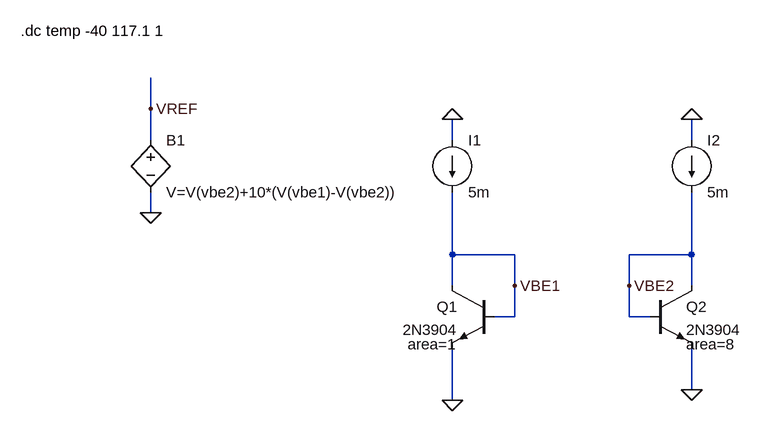
[diagram p0: schematic Ideal_Bandgap_Model.asc]
Ideal_Bandgap_Model.asc, the LTspice schematic file:
Version 4.1
SHEET 1 880 680
WIRE -64 128 -64 80
WIRE -64 176 -64 128
WIRE 400 176 400 144
WIRE 768 176 768 144
WIRE -64 288 -64 256
WIRE 400 352 400 256
WIRE 496 352 400 352
WIRE 768 352 768 256
WIRE 768 352 672 352
WIRE 400 400 400 352
WIRE 496 400 496 352
WIRE 672 400 672 352
WIRE 768 400 768 352
WIRE 496 448 496 400
WIRE 496 448 464 448
WIRE 672 448 672 400
WIRE 704 448 672 448
WIRE 768 560 768 496
WIRE 400 576 400 496
FLAG 400 576 0
FLAG 768 560 0
FLAG 400 144 0
FLAG 496 400 VBE1
FLAG 672 400 VBE2
FLAG 768 144 0
FLAG -64 288 0
FLAG -64 128 VREF
SYMBOL current 400 176 R0
SYMATTR InstName I1
SYMATTR Value 5m
SYMBOL npn 464 400 M0
WINDOW 39 56 90 Left 2
SYMATTR SpiceLine area=1
SYMATTR InstName Q1
SYMATTR Value 2N3904
SYMBOL npn 704 400 R0
WINDOW 39 56 90 Left 2
SYMATTR SpiceLine area=8
SYMATTR InstName Q2
SYMATTR Value 2N3904
SYMBOL current 768 176 R0
SYMATTR InstName I2
SYMATTR Value 5m
SYMBOL bv -64 160 R0
SYMATTR InstName B1
SYMATTR Value V=V(vbe2)+10*(V(vbe1)-V(vbe2))
TEXT -264 8 Left 2 !.dc temp -40 117.1 1

The netlist it stands for:
* Ideal_Bandgap_Model.asc
I1 0 VBE1 5m
Q1 VBE1 VBE1 0 0 2N3904 area=1
Q2 VBE2 VBE2 0 0 2N3904 area=8
I2 0 VBE2 5m
B1 VREF 0 V=V(vbe2)+10*(V(vbe1)-V(vbe2))
.model NPN NPN
.model PNP PNP
.lib standard.bjt
.dc temp -40 117.1 1
.backanno
.end